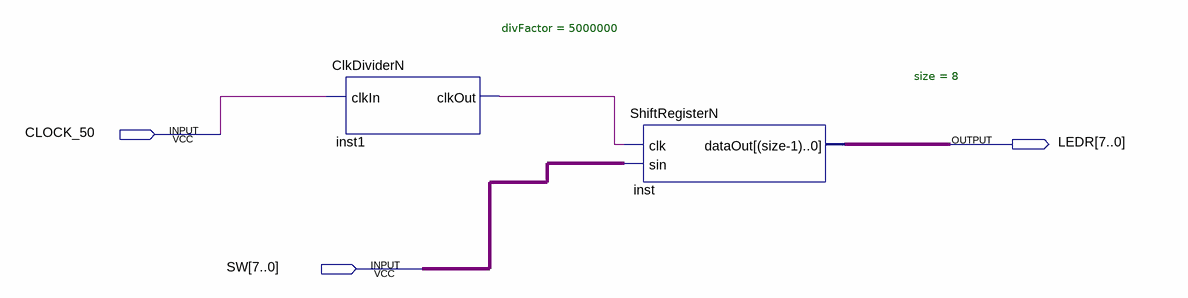
[diagram p0: schematic sheet]
// Quartus schematic ShiftRegister_Demo.bdf as structural Verilog: 2 symbols, 3 pins
module ShiftRegister_Demo (
  input  CLOCK_50,
  input  [7:0] SW,
  output [7:0] LEDR
);

  wire inst1_clkout;

  ClkDividerN #(.divFactor(5000000)) inst1 (.clkIn(CLOCK_50), .clkOut(inst1_clkout));
  ShiftRegisterN #(.size(8)) inst (.clk(inst1_clkout), .sin(SW), .dataOut(LEDR));
endmodule
